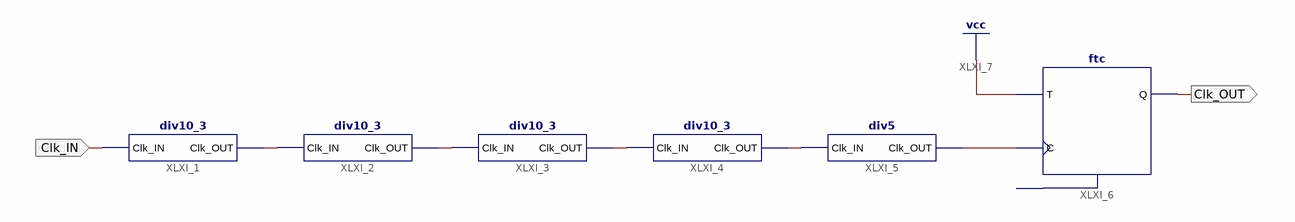
[diagram p0: schematic sheet 1]
// Xilinx ISE schematic ClkForDot.sch (spartan6) as structural Verilog: 6 symbols, 2 ports
module ClkForDot (
  input  Clk_IN,
  output Clk_OUT
);

  wire XLXN_7, XLXN_8, XLXN_9, XLXN_10, XLXN_11;

  div10_3 XLXI_1 (.Clk_IN(Clk_IN), .Clk_OUT(XLXN_7));
  div10_3 XLXI_2 (.Clk_IN(XLXN_7), .Clk_OUT(XLXN_8));
  div10_3 XLXI_3 (.Clk_IN(XLXN_8), .Clk_OUT(XLXN_9));
  div10_3 XLXI_4 (.Clk_IN(XLXN_9), .Clk_OUT(XLXN_10));
  div5 XLXI_5 (.Clk_IN(XLXN_10), .Clk_OUT(XLXN_11));
  ftc XLXI_6 (.C(XLXN_11), .T(1'b1), .Q(Clk_OUT));  // open: CLR
endmodule
